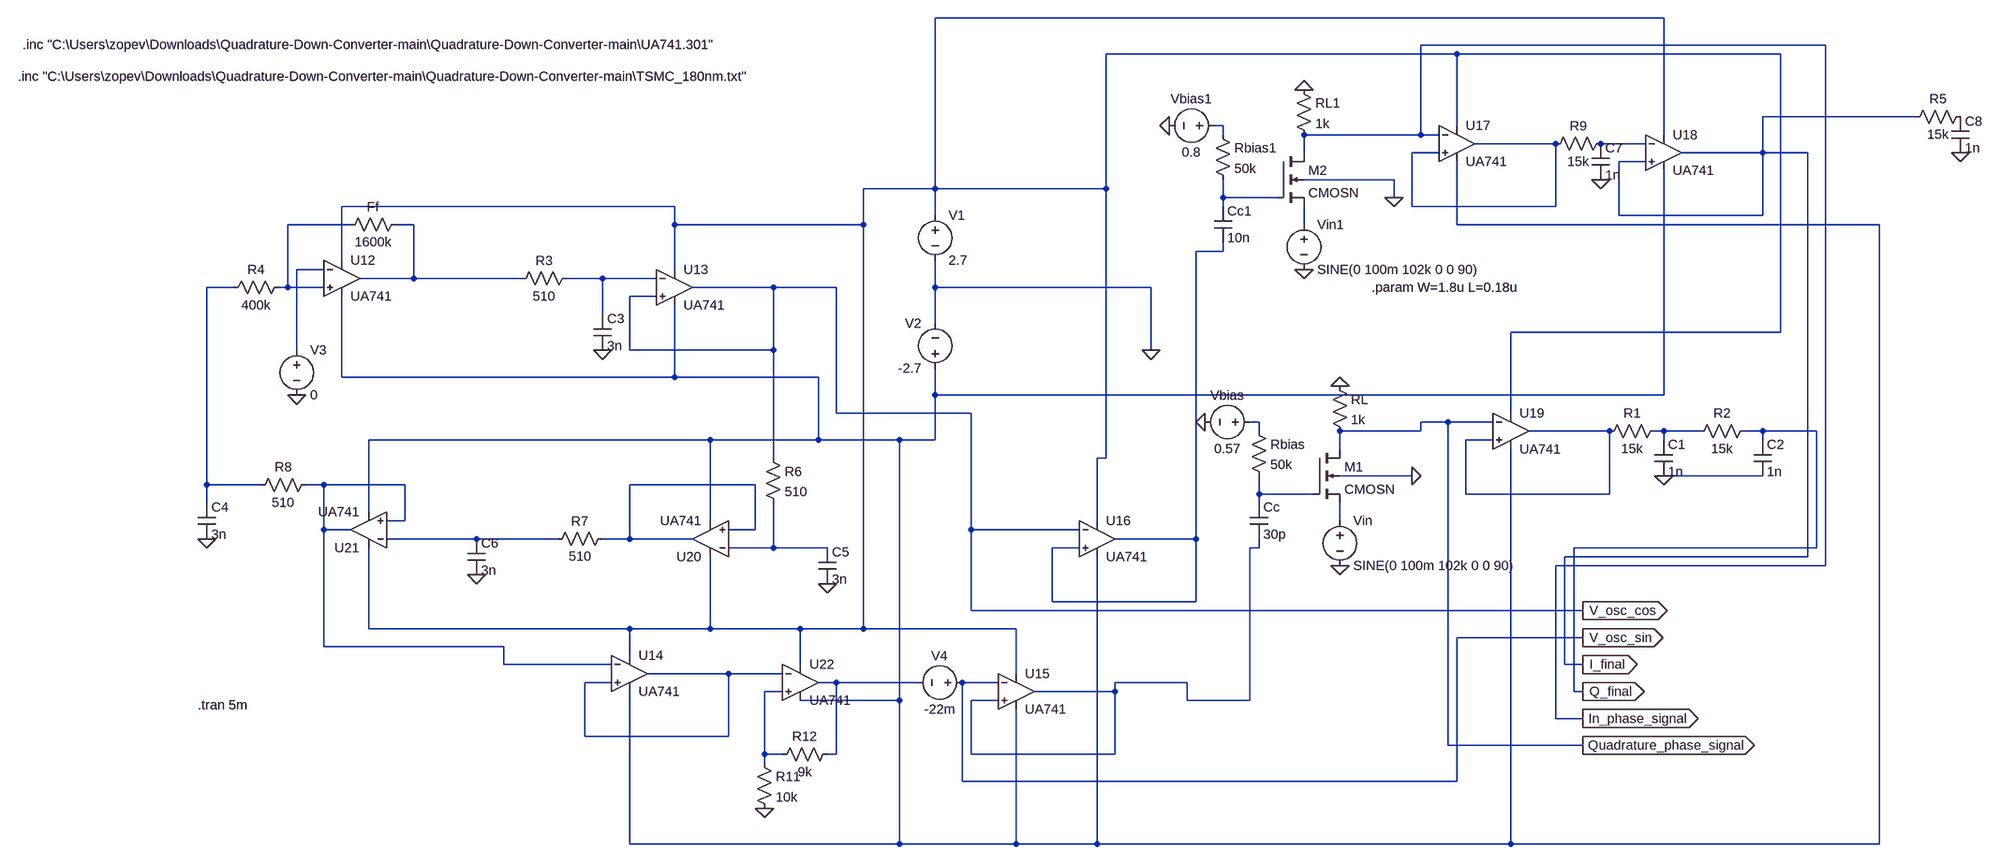
[diagram p0: schematic QuadDownConverter.asc]
QuadDownConverter.asc, the LTspice schematic file:
Version 4.1
SHEET 1 2040 696
WIRE 704 -784 -592 -784
WIRE 992 -736 272 -736
WIRE 336 -720 -288 -720
WIRE 912 -720 336 -720
WIRE 1152 -608 880 -608
WIRE -80 -592 -96 -592
WIRE 336 -592 336 -720
WIRE -80 -576 -80 -592
WIRE 272 -576 272 -736
WIRE 272 -576 64 -576
WIRE 304 -576 272 -576
WIRE 704 -576 704 -784
WIRE 512 -560 368 -560
WIRE 672 -560 592 -560
WIRE 64 -544 64 -576
WIRE 304 -544 256 -544
WIRE 880 -544 880 -608
WIRE 880 -544 736 -544
WIRE 960 -544 880 -544
WIRE 672 -528 624 -528
WIRE 224 -496 64 -496
WIRE -592 -480 -592 -784
WIRE -592 -480 -720 -480
WIRE -288 -480 -288 -720
WIRE -288 -480 -592 -480
WIRE -80 -464 -80 -496
WIRE 16 -464 -80 -464
WIRE 224 -464 224 -496
WIRE -1056 -448 -1648 -448
WIRE -80 -448 -80 -464
WIRE 256 -448 256 -544
WIRE 512 -448 512 -560
WIRE 512 -448 256 -448
WIRE -592 -432 -592 -480
WIRE 624 -432 624 -528
WIRE 880 -432 880 -544
WIRE 880 -432 624 -432
WIRE -1632 -416 -1744 -416
WIRE -1520 -416 -1552 -416
WIRE -1056 -416 -1056 -448
WIRE -720 -416 -720 -480
WIRE -720 -416 -1056 -416
WIRE 64 -416 64 -448
WIRE 336 -416 336 -528
WIRE 1088 -416 336 -416
WIRE -80 -368 -80 -384
WIRE -80 -368 -128 -368
WIRE -1648 -352 -1648 -448
WIRE -1680 -336 -1728 -336
WIRE -1056 -336 -1056 -416
WIRE -1520 -320 -1520 -416
WIRE -1520 -320 -1616 -320
WIRE -1328 -320 -1520 -320
WIRE -1184 -320 -1248 -320
WIRE -1088 -320 -1184 -320
WIRE -1840 -304 -1888 -304
WIRE -1744 -304 -1744 -416
WIRE -1744 -304 -1760 -304
WIRE -1680 -304 -1744 -304
WIRE -880 -304 -1024 -304
WIRE -768 -304 -880 -304
WIRE -592 -304 -592 -352
WIRE -208 -304 -592 -304
WIRE -1088 -288 -1136 -288
WIRE -1184 -256 -1184 -320
WIRE -592 -240 -592 -304
WIRE 912 -224 912 -720
WIRE 912 -224 432 -224
WIRE -1728 -192 -1728 -336
WIRE -1136 -192 -1136 -288
WIRE -880 -192 -880 -304
WIRE -880 -192 -1136 -192
WIRE -208 -192 -208 -304
WIRE -1648 -144 -1648 -288
WIRE -1056 -144 -1056 -272
WIRE -1056 -144 -1648 -144
WIRE -800 -144 -1056 -144
WIRE -592 -112 -592 -160
WIRE 704 -112 704 -512
WIRE 704 -112 -592 -112
WIRE -768 -80 -768 -304
WIRE -528 -80 -768 -80
WIRE 432 -80 432 -224
WIRE -16 -64 -32 -64
WIRE 320 -64 272 -64
WIRE 400 -64 320 -64
WIRE -16 -48 -16 -64
WIRE 272 -48 272 -64
WIRE 272 -48 128 -48
WIRE 608 -48 464 -48
WIRE 704 -48 688 -48
WIRE 768 -48 704 -48
WIRE 880 -48 848 -48
WIRE 976 -48 880 -48
WIRE -992 -32 -1600 -32
WIRE -800 -32 -800 -144
WIRE -800 -32 -992 -32
WIRE -656 -32 -800 -32
WIRE -592 -32 -592 -112
WIRE -592 -32 -656 -32
WIRE 400 -32 352 -32
WIRE 704 -32 704 -48
WIRE 880 -32 880 -48
WIRE 128 -16 128 -48
WIRE -880 0 -880 -192
WIRE -288 0 -288 -480
WIRE -288 0 -304 0
WIRE 256 32 128 32
WIRE 880 32 704 32
WIRE -1888 48 -1888 -304
WIRE -1792 48 -1888 48
WIRE -1680 48 -1712 48
WIRE -1536 48 -1680 48
WIRE -912 48 -1136 48
WIRE -16 64 -16 32
WIRE 80 64 -16 64
WIRE 352 64 352 -32
WIRE 608 64 608 -48
WIRE 608 64 352 64
WIRE -1888 80 -1888 48
WIRE -16 80 -16 64
WIRE -1600 96 -1600 -32
WIRE -1536 112 -1536 48
WIRE -1536 112 -1568 112
WIRE -992 112 -992 -32
WIRE -304 112 -304 0
WIRE 128 112 128 80
WIRE -1680 128 -1680 48
WIRE -1632 128 -1680 128
WIRE -912 128 -912 48
WIRE -912 128 -960 128
WIRE -528 128 -528 -80
WIRE -336 128 -528 128
WIRE -1408 144 -1568 144
WIRE -1264 144 -1408 144
WIRE -1136 144 -1136 48
WIRE -1136 144 -1184 144
WIRE -1024 144 -1136 144
WIRE -128 144 -128 -368
WIRE -128 144 -272 144
WIRE -880 160 -880 80
WIRE -880 160 -960 160
WIRE -784 160 -880 160
WIRE -336 160 -384 160
WIRE -16 160 -16 144
WIRE -16 160 -32 160
WIRE 976 160 976 -48
WIRE 976 160 544 160
WIRE 960 176 960 -544
WIRE 960 176 528 176
WIRE 992 192 992 -736
WIRE 992 192 512 192
WIRE -384 256 -384 160
WIRE -128 256 -128 144
WIRE -128 256 -384 256
WIRE -528 272 -528 128
WIRE 560 272 -528 272
WIRE -1600 304 -1600 160
WIRE -1136 304 -1600 304
WIRE -992 304 -992 176
WIRE -992 304 -1136 304
WIRE -832 304 -992 304
WIRE -720 304 -720 -416
WIRE -720 304 -832 304
WIRE -448 304 -720 304
WIRE 560 320 336 320
WIRE -1680 336 -1680 128
WIRE -1360 336 -1680 336
WIRE -1136 352 -1136 304
WIRE -1360 368 -1360 336
WIRE -1168 368 -1360 368
WIRE -832 368 -832 304
WIRE 528 368 528 176
WIRE 560 368 528 368
WIRE -960 384 -1104 384
WIRE -864 384 -960 384
WIRE -448 384 -448 304
WIRE -1168 400 -1216 400
WIRE -768 400 -800 400
WIRE -624 400 -768 400
WIRE -480 400 -544 400
WIRE -144 400 -272 400
WIRE -864 416 -896 416
WIRE -272 416 -272 400
WIRE -272 416 -416 416
WIRE 544 416 544 160
WIRE 560 416 544 416
WIRE -656 432 -656 -32
WIRE -656 432 -832 432
WIRE -480 432 -528 432
WIRE -144 432 -144 400
WIRE -32 432 -32 160
WIRE -32 432 -144 432
WIRE 512 464 512 192
WIRE 560 464 512 464
WIRE -1216 496 -1216 400
WIRE -960 496 -960 384
WIRE -960 496 -1216 496
WIRE 320 512 320 -64
WIRE 560 512 320 512
WIRE -896 528 -896 416
WIRE -864 528 -896 528
WIRE -768 528 -768 400
WIRE -768 528 -784 528
WIRE -528 528 -528 432
WIRE -272 528 -272 416
WIRE -272 528 -528 528
WIRE -896 544 -896 528
WIRE -544 576 -544 400
WIRE 336 576 336 320
WIRE 336 576 -544 576
WIRE -1136 688 -1136 416
WIRE -656 688 -656 432
WIRE -656 688 -1136 688
WIRE -448 688 -448 448
WIRE -448 688 -656 688
WIRE -304 688 -304 176
WIRE -304 688 -448 688
WIRE 432 688 432 -16
WIRE 432 688 -304 688
WIRE 1088 688 1088 -416
WIRE 1088 688 432 688
FLAG -112 -64 0
FLAG 128 -128 0
FLAG 128 192 0
FLAG -1184 -192 0
FLAG -1888 144 0
FLAG -784 224 0
FLAG -1408 208 0
FLAG -208 -192 0
FLAG 560 272 V_osc_cos
IOPIN 560 272 Out
FLAG -1728 -112 0
FLAG -176 -592 0
FLAG 64 -656 0
FLAG 64 -336 0
FLAG 224 -464 0
FLAG -896 624 0
FLAG 256 32 0
FLAG 704 32 0
FLAG 560 320 V_osc_sin
IOPIN 560 320 Out
FLAG 560 416 Q_final
IOPIN 560 416 Out
FLAG 560 368 I_final
IOPIN 560 368 Out
FLAG 560 464 In_phase_signal
IOPIN 560 464 Out
FLAG 560 512 Quadrature_phase_signal
IOPIN 560 512 Out
FLAG 1232 -544 0
FLAG 592 -496 0
SYMBOL nmos4 80 -16 R0
SYMATTR InstName M1
SYMATTR Value CMOSN
SYMBOL cap -32 80 R0
SYMATTR InstName Cc
SYMATTR Value 30p
SYMBOL res -32 -64 R0
SYMATTR InstName Rbias
SYMATTR Value 50k
SYMBOL voltage -16 -64 R90
WINDOW 0 -32 56 VBottom 2
WINDOW 3 32 56 VTop 2
WINDOW 123 0 0 Left 0
WINDOW 39 0 0 Left 0
SYMATTR InstName Vbias
SYMATTR Value 0.57
SYMBOL voltage 128 96 R0
WINDOW 123 0 0 Left 0
WINDOW 39 0 0 Left 0
SYMATTR InstName Vin
SYMATTR Value SINE(0 100m 102k 0 0 90)
SYMBOL res 112 -144 R0
SYMATTR InstName RL
SYMATTR Value 1k
SYMBOL res 704 -64 R90
WINDOW 0 0 56 VBottom 2
WINDOW 3 32 56 VTop 2
SYMATTR InstName R1
SYMATTR Value 15k
SYMBOL cap 688 -32 R0
SYMATTR InstName C1
SYMATTR Value 1n
SYMBOL res 864 -64 R90
WINDOW 0 0 56 VBottom 2
WINDOW 3 32 56 VTop 2
SYMATTR InstName R2
SYMATTR Value 15k
SYMBOL cap 864 -32 R0
SYMATTR InstName C2
SYMATTR Value 1n
SYMBOL res -1344 -304 R270
WINDOW 0 32 56 VTop 2
WINDOW 3 0 56 VBottom 2
SYMATTR InstName R3
SYMATTR Value 510
SYMBOL cap -1200 -256 R0
SYMATTR InstName C3
SYMATTR Value 3n
SYMBOL res -1744 -320 R90
WINDOW 0 0 56 VBottom 2
WINDOW 3 32 56 VTop 2
SYMATTR InstName R4
SYMATTR Value 400k
SYMBOL cap -1904 80 R0
SYMATTR InstName C4
SYMATTR Value 3n
SYMBOL voltage -592 -448 R0
WINDOW 123 0 0 Left 0
WINDOW 39 0 0 Left 0
SYMATTR InstName V1
SYMATTR Value 2.7
SYMBOL res -1536 -432 R90
WINDOW 0 0 56 VBottom 2
WINDOW 3 32 56 VTop 2
SYMATTR InstName Ff
SYMATTR Value 1600k
SYMBOL cap -800 160 R0
SYMATTR InstName C5
SYMATTR Value 3n
SYMBOL res -896 -16 R0
SYMATTR InstName R6
SYMATTR Value 510
SYMBOL res -1168 128 R90
WINDOW 0 0 56 VBottom 2
WINDOW 3 32 56 VTop 2
SYMATTR InstName R7
SYMATTR Value 510
SYMBOL cap -1424 144 R0
SYMATTR InstName C6
SYMATTR Value 3n
SYMBOL res -1696 32 R90
WINDOW 0 0 56 VBottom 2
WINDOW 3 32 56 VTop 2
SYMATTR InstName R8
SYMATTR Value 510
SYMBOL voltage -592 -144 R180
WINDOW 0 24 96 Left 2
WINDOW 3 24 16 Left 2
WINDOW 123 0 0 Left 0
WINDOW 39 0 0 Left 0
SYMATTR InstName V2
SYMATTR Value -2.7
SYMBOL voltage -1728 -208 R0
WINDOW 123 0 0 Left 0
WINDOW 39 0 0 Left 0
SYMATTR InstName V3
SYMATTR Value 0
SYMBOL nmos4 16 -544 R0
SYMATTR InstName M2
SYMATTR Value CMOSN
SYMATTR Value2 l={L} w={W} ad={5*{W}*{L/2 }} as={5*{W}*{L/2 }} pd={5*{L} + 2*{W}} ps={5*{L} + 2*{W}}
SYMBOL cap -96 -448 R0
SYMATTR InstName Cc1
SYMATTR Value 10n
SYMBOL res -96 -592 R0
SYMATTR InstName Rbias1
SYMATTR Value 50k
SYMBOL voltage -80 -592 R90
WINDOW 0 -32 56 VBottom 2
WINDOW 3 32 56 VTop 2
WINDOW 123 0 0 Left 0
WINDOW 39 0 0 Left 0
SYMATTR InstName Vbias1
SYMATTR Value 0.8
SYMBOL voltage 64 -432 R0
WINDOW 123 0 0 Left 0
WINDOW 39 0 0 Left 0
SYMATTR InstName Vin1
SYMATTR Value SINE(0 100m 102k 0 0 90)
SYMBOL res 48 -672 R0
SYMATTR InstName RL1
SYMATTR Value 1k
SYMBOL res 608 -576 R90
WINDOW 0 0 56 VBottom 2
WINDOW 3 32 56 VTop 2
SYMATTR InstName R9
SYMATTR Value 15k
SYMBOL res -912 528 R0
SYMATTR InstName R11
SYMATTR Value 10k
SYMBOL res -768 512 R90
WINDOW 0 0 56 VBottom 2
WINDOW 3 32 56 VTop 2
SYMATTR InstName R12
SYMATTR Value 9k
SYMBOL voltage -528 400 R90
WINDOW 0 -32 56 VBottom 2
WINDOW 3 32 56 VTop 2
WINDOW 123 0 0 Left 0
WINDOW 39 0 0 Left 0
SYMATTR InstName V4
SYMATTR Value -22m
SYMBOL cap 576 -560 R0
SYMATTR InstName C7
SYMATTR Value 1n
SYMBOL res 1248 -624 R90
WINDOW 0 0 56 VBottom 2
WINDOW 3 32 56 VTop 2
SYMATTR InstName R5
SYMATTR Value 15k
SYMBOL cap 1216 -608 R0
SYMATTR InstName C8
SYMATTR Value 1n
SYMBOL OpAmps\\opamp2 -1648 -384 R0
SYMATTR InstName U12
SYMATTR Value UA741
SYMBOL OpAmps\\opamp2 -1056 -368 R0
SYMATTR InstName U13
SYMATTR Value UA741
SYMBOL OpAmps\\opamp2 -1136 320 R0
SYMATTR InstName U14
SYMATTR Value UA741
SYMBOL OpAmps\\opamp2 -448 352 R0
SYMATTR InstName U15
SYMATTR Value UA741
SYMBOL OpAmps\\opamp2 -304 80 R0
SYMATTR InstName U16
SYMATTR Value UA741
SYMBOL OpAmps\\opamp2 336 -624 R0
SYMATTR InstName U17
SYMATTR Value UA741
SYMBOL OpAmps\\opamp2 704 -608 R0
SYMATTR InstName U18
SYMATTR Value UA741
SYMBOL OpAmps\\opamp2 432 -112 R0
SYMATTR InstName U19
SYMATTR Value UA741
SYMBOL OpAmps\\opamp2 -992 208 R180
SYMATTR InstName U20
SYMATTR Value UA741
SYMBOL OpAmps\\opamp2 -1600 192 R180
SYMATTR InstName U21
SYMATTR Value UA741
SYMBOL OpAmps\\opamp2 -832 336 R0
SYMATTR InstName U22
SYMATTR Value UA741
TEXT -1904 440 Left 2 !.tran 5m
TEXT 184 -304 Left 2 !.param W=1.8u L=0.18u
TEXT -2216 -736 Left 2 !.inc "C:\\Users\\zopev\\Downloads\\Quadrature-Down-Converter-main\\Quadrature-Down-Converter-main\\UA741.301"
TEXT -2224 -680 Left 2 !.inc "C:\\Users\\zopev\\Downloads\\Quadrature-Down-Converter-main\\Quadrature-Down-Converter-main\\TSMC_180nm.txt"

The netlist it stands for:
* QuadDownConverter.asc
M1 Quadrature_phase_signal N019 N020 0 CMOSN
Cc N019 N023 30p
Rbias N014 N019 50k
Vbias N014 0 0.57
Vin N020 0 SINE(0 100m 102k 0 0 90)
RL 0 Quadrature_phase_signal 1k
R1 N016 N015 15k
C1 N016 0 1n
R2 Q_final N016 15k
C2 Q_final 0 1n
R3 N007 N012 510
C3 N012 0 3n
R4 N006 N013 400k
C4 N013 0 3n
V1 N001 0 2.7
R§Ff N007 N006 1600k
C5 N022 0 3n
R6 V_osc_cos N022 510
R7 N018 N021 510
C6 N021 0 3n
R8 N017 N013 510
V2 N009 0 -2.7
V3 N011 0 0
M2 In_phase_signal N005 N008 0 CMOSN l={L} w={W} ad={5*{W}*{L/2 }} as={5*{W}*{L/2 }} pd={5*{L} + 2*{W}} ps={5*{L} + 2*{W}}
Cc1 N005 N010 10n
Rbias1 N002 N005 50k
Vbias1 N002 0 0.8
Vin1 N008 0 SINE(0 100m 102k 0 0 90)
RL1 0 In_phase_signal 1k
R9 N004 N003 15k
R11 N026 0 10k
R12 N025 N026 9k
V4 V_osc_sin N025 -22m
C7 N004 0 1n
R5 P001 I_final 15k
C8 P001 0 1n
X§U12 N006 N011 N001 N009 N007 UA741  ; pins In+ In- V+ V- OUT
X§U13 V_osc_cos N012 N001 N009 V_osc_cos UA741  ; pins In+ In- V+ V- OUT
X§U14 N024 N017 N001 N009 N024 UA741  ; pins In+ In- V+ V- OUT
X§U15 N023 V_osc_sin N001 N009 N023 UA741  ; pins In+ In- V+ V- OUT
X§U16 N010 V_osc_cos N001 N009 N010 UA741  ; pins In+ In- V+ V- OUT
X§U17 N003 In_phase_signal N001 N009 N003 UA741  ; pins In+ In- V+ V- OUT
X§U18 I_final N004 N001 N009 I_final UA741  ; pins In+ In- V+ V- OUT
X§U19 N015 Quadrature_phase_signal N001 N009 N015 UA741  ; pins In+ In- V+ V- OUT
X§U20 N018 N022 N001 N009 N018 UA741  ; pins In+ In- V+ V- OUT
X§U21 N017 N021 N001 N009 N017 UA741  ; pins In+ In- V+ V- OUT
X§U22 N026 N024 N001 N009 N025 UA741  ; pins In+ In- V+ V- OUT
.model NMOS NMOS
.model PMOS PMOS
.lib standard.mos
.tran 5m
.param W=1.8u L=0.18u
.inc "C:\Users\zopev\Downloads\Quadrature-Down-Converter-main\Quadrature-Down-Converter-main\UA741.301"
.inc "C:\Users\zopev\Downloads\Quadrature-Down-Converter-main\Quadrature-Down-Converter-main\TSMC_180nm.txt"
.backanno
.end